# Altium project Wearable_sensor_v2.0.PrjPcb
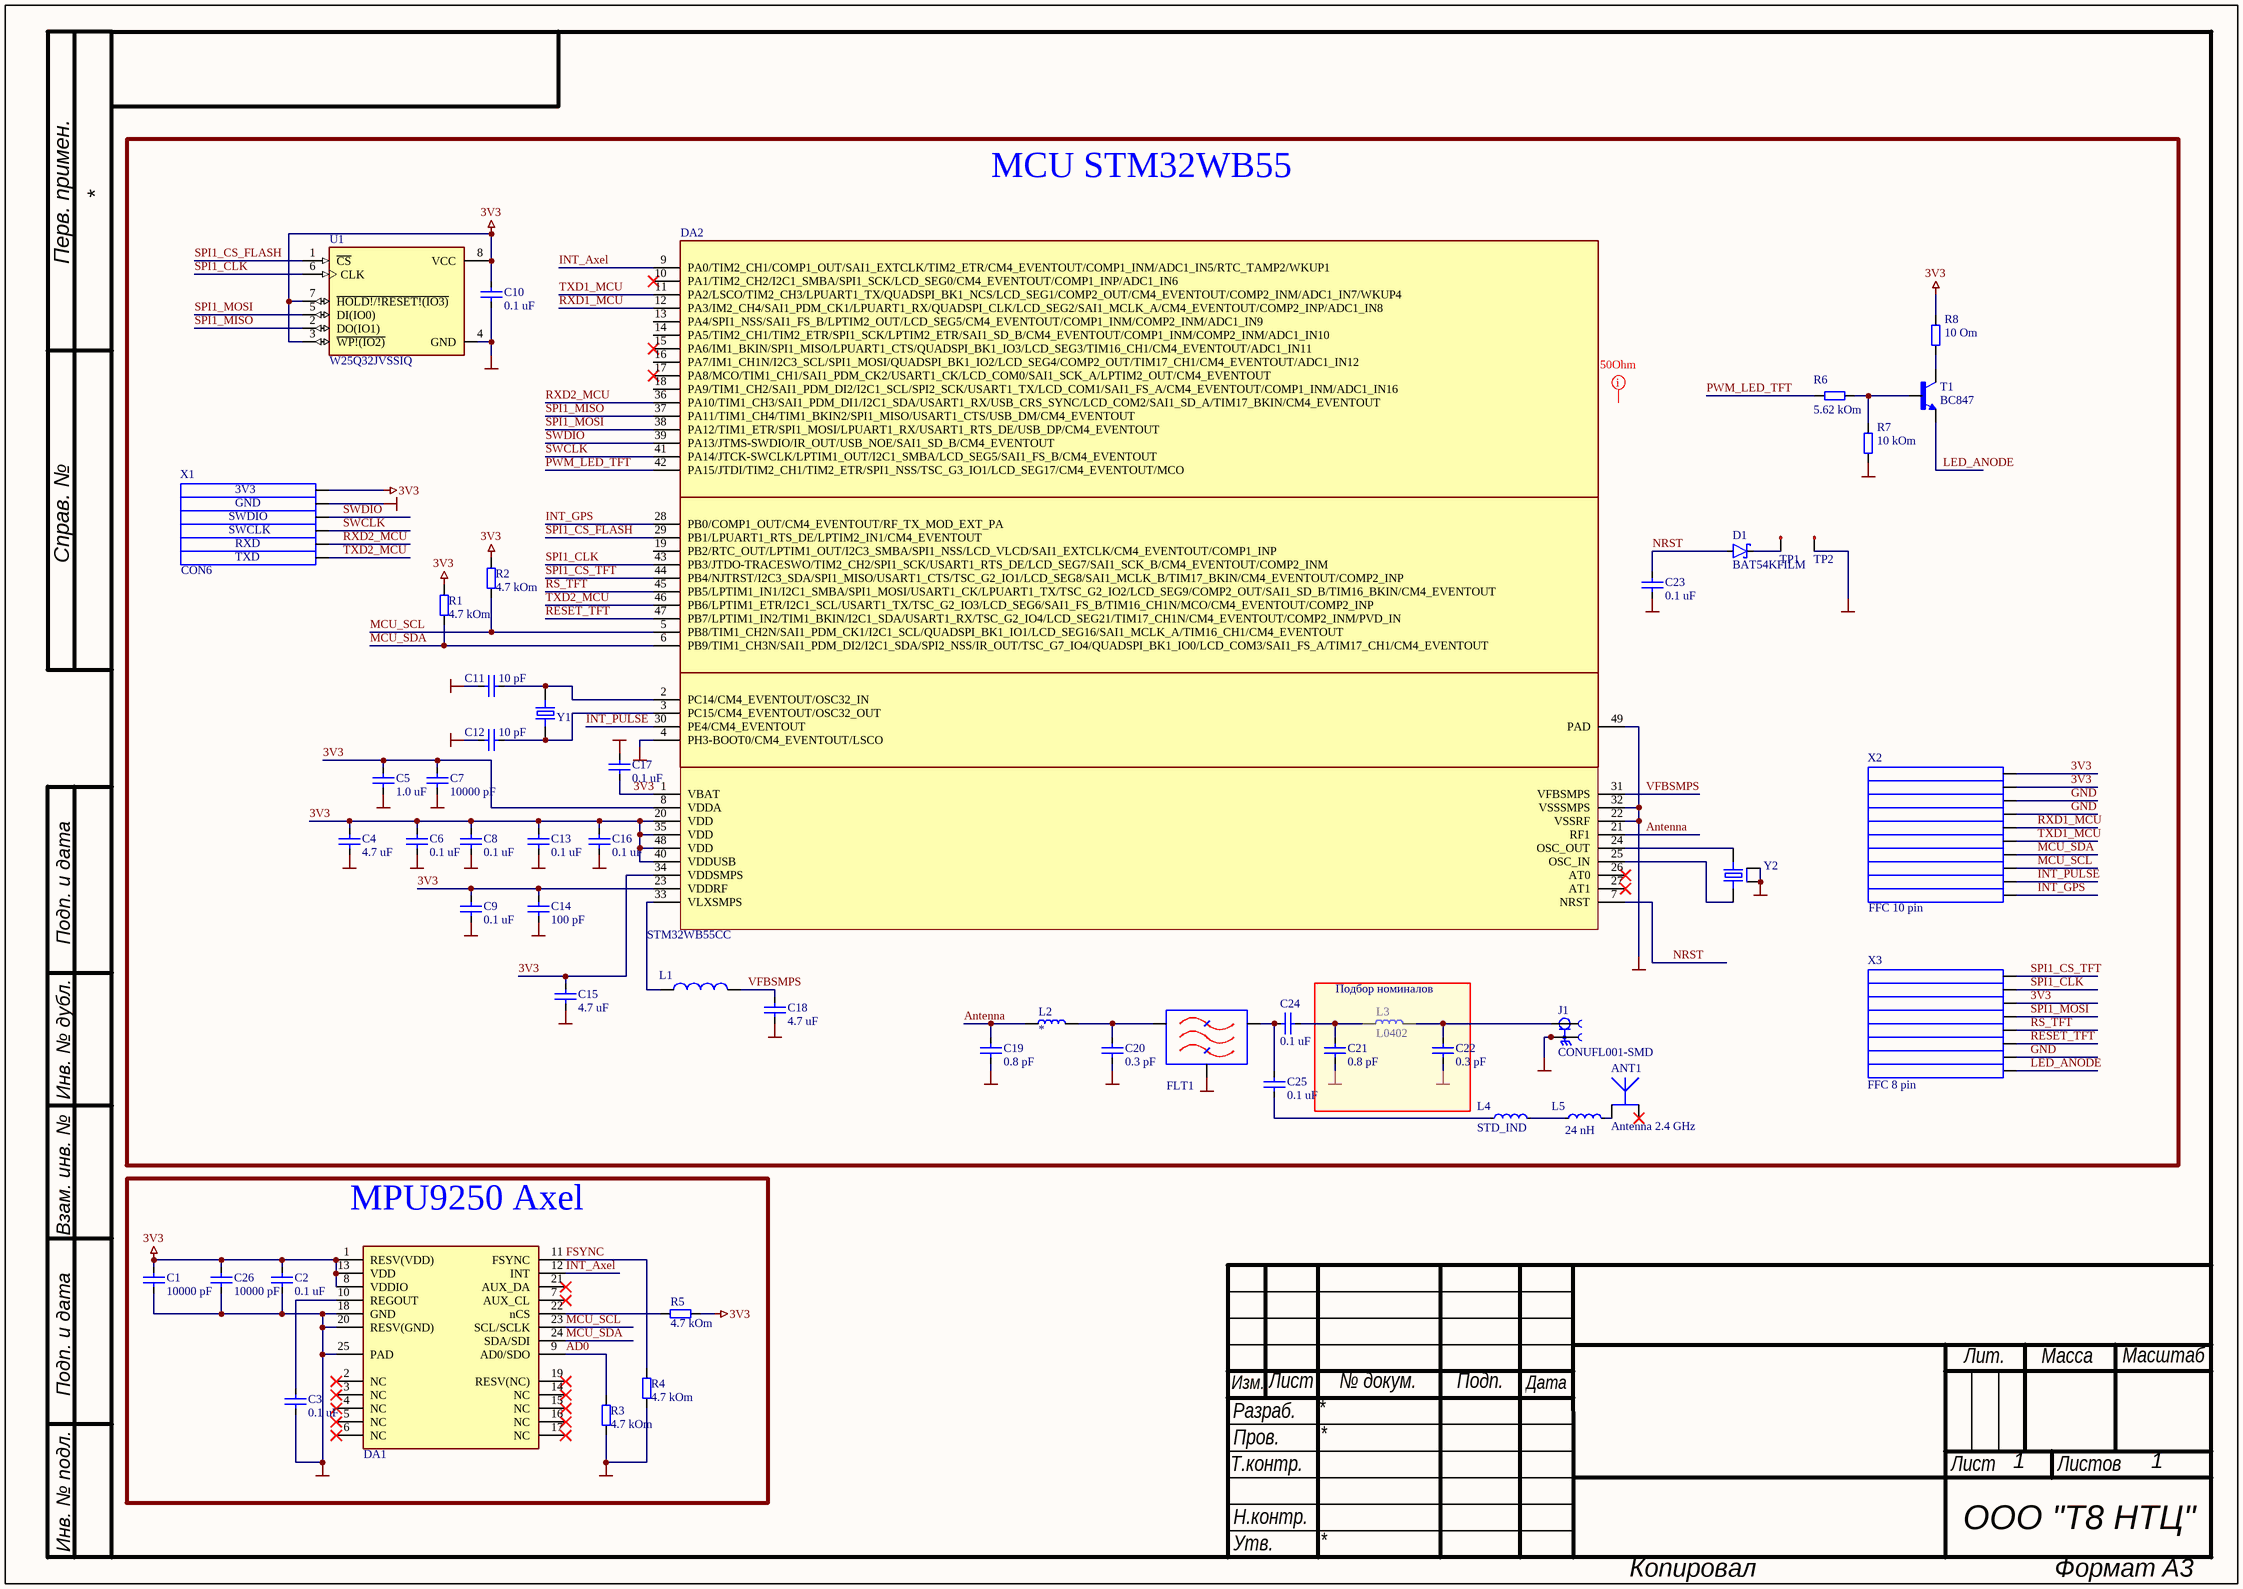
[diagram p0: Wearable_sensor_v2.0.SchDoc]
1 sheet, 54 parts. Net scope: global (net labels, ports and power ports of the same name join across sheets).
Board file: Wearable_sensor_v2.0.PcbDoc

## Sheet Wearable_sensor_v2.0.SchDoc
size 420 x 297 mm; SheetNumber: 1; SheetTotal: 1

### Parts
ANT1  Antenna 2.4 GHz  [RFANT3216120A5T]
C1  value 10000 pF  [CAPC1005X55N]  (hidden comment: STD_CAP)
C2  value 0.1 uF  [CAPC1005X55N]  (hidden comment: STD_CAP)
C3  value 0.1 uF  [CAPC1005X55N]  (hidden comment: STD_CAP)
C4  value 4.7 uF  [CAPC1005X55N]  (hidden comment: STD_CAP)
C5  value 1.0 uF  [CAPC1005X55N]  (hidden comment: STD_CAP)
C6  value 0.1 uF  [CAPC1005X55N]  (hidden comment: STD_CAP)
C7  value 10000 pF  [CAPC1005X55N]  (hidden comment: STD_CAP)
C8  value 0.1 uF  [CAPC1005X55N]  (hidden comment: STD_CAP)
C9  value 0.1 uF  [CAPC1005X55N]  (hidden comment: STD_CAP)
C10  value 0.1 uF  [CAPC1005X55N]  (hidden comment: STD_CAP)
C11  value 10 pF  [CAPC1005X55N]  (hidden comment: STD_CAP)
C12  value 10 pF  [CAPC1005X55N]  (hidden comment: STD_CAP)
C13  value 0.1 uF  [CAPC1005X55N]  (hidden comment: STD_CAP)
C14  value 100 pF  [CAPC1005X55N]  (hidden comment: STD_CAP)
C15  value 4.7 uF  [CAPC1005X55N]  (hidden comment: STD_CAP)
C16  value 0.1 uF  [CAPC1005X55N]  (hidden comment: STD_CAP)
C17  value 0.1 uF  [CAPC1005X55N]  (hidden comment: STD_CAP)
C18  value 4.7 uF  [CAPC1005X55N]  (hidden comment: STD_CAP)
C19  value 0.8 pF  [CAPC1005X55N]  (hidden comment: STD_CAP)
C20  value 0.3 pF  [CAPC1005X55N]  (hidden comment: STD_CAP)
C21  value 0.8 pF  [CAPC1005X55N]  (hidden comment: STD_CAP)
C22  value 0.3 pF  [CAPC1005X55N]  (hidden comment: STD_CAP)
C23  value 0.1 uF  [CAPC1005X55N]  (hidden comment: STD_CAP)
C24  value 0.1 uF  [CAPC1005X55N]  (hidden comment: STD_CAP)
C25  value 0.1 uF  [CAPC1005X55N]  (hidden comment: STD_CAP)
C26  value 10000 pF  [CAPC1005X55N]  (hidden comment: STD_CAP)
D1  BAT54KFILM  [SOD523]
DA1  IventSense_MPU-9250  [QFN24 3x3x1mm]  (value not drawn)
DA2  STM32WB55CC  [UFQFPN48]
FLT1  DEA162450-1260B2  [FIL_DEA160915LT-1169]  (value not drawn)
J1  CONUFL001-SMD  [LINX_CONUFL001-SMD]
L1  MLF2012E100KT000  [INDC2012X145N]  (value not drawn)
L2  L0402  [L0402]  (value not drawn)
L3  L0402  [L0402]
L4  STD_IND  [RESC1005X40N]
L5  value 24 nH  [RESC1005X40N]  (hidden comment: STD_IND)
R1  value 4.7 kOm  [RESC1005X40N]  (hidden comment: STD_RES)
R2  value 4.7 kOm  [RESC1005X40N]  (hidden comment: STD_RES)
R3  value 4.7 kOm  [RESC1005X40N]  (hidden comment: STD_RES)
R4  value 4.7 kOm  [RESC1005X40N]  (hidden comment: STD_RES)
R5  value 4.7 kOm  [RESC1005X40N]  (hidden comment: STD_RES)
R6  value 5.62 kOm  [RESC1005X40N]  (hidden comment: STD_RES)
R7  value 10 kOm  [RESC1005X40N]  (hidden comment: STD_RES)
R8  value 10 Om  [RESC1005X40N]  (hidden comment: STD_RES)
T1  BC847  [SOT23]
TP1  Test Point  [Test point]  (value not drawn)
TP2  Test Point  [Test point]  (value not drawn)
U1  W25Q32JVSSIQ  [SOIC127P790X216-8N]
X1  CON6  [CON6 cabel]
X2  FFC 10 pin  [SAMTEC_ZF5S-10-01-T-WT]
X3  FFC 8 pin  [68710814022]
Y1  NX2012SA-32.768K-STD-MUB-1_1  [XTAL_NX2012SA-32.768K-STD-MUB-1]  (value not drawn)
Y2  NX2016_32M  [NX2016_32M]  (value not drawn)

### Blocks framed on the sheet
MCU STM32WB55: ANT1 C4-C20 C23-C25 D1 DA2 FLT1 J1 L1 L2 L4 L5 R1 R2 R6-R8 T1 TP1 TP2 U1 X1-X3 Y1 Y2
Подбор номиналов: C21 C22 L3
MPU9250 Axel: C1-C3 C26 DA1 R3-R5

### Nets
3V3: C1.1 C2.1 C4.1 C5.1 C6.1 C7.1 C8.1 C9.1 C10.1 C13.1 C14.1 C15.1 C16.1 C17.2 C26.1 DA1.1(RESV(VDD)) DA1.8(VDDIO) DA1.13(VDD) DA2.1(VBAT) DA2.8(VDDA) DA2.20(VDD) DA2.23(VDDRF) DA2.34(VDDSMPS) DA2.35(VDD) DA2.40(VDDUSB) DA2.48(VDD) R1.2 R2.2 R5.1 R8.2 U1.3(~{WP!(IO2)}) U1.7(~{HOLD!/!RESET!(IO3)}) U1.8(VCC) X1.1 X2.1 X2.2 X3.3
GND: C1.2 C2.2 C3.2 C4.2 C5.2 C6.2 C7.2 C8.2 C9.2 C10.2 C11.2 C12.2 C13.2 C14.2 C15.2 C16.2 C17.1 C18.2 C19.2 C20.2 C21.2 C22.2 C23.2 C26.2 DA1.18(GND) DA1.20(RESV(GND)) DA1.25(PAD) DA2.4(PH3-BOOT0/CM4_EVENTOUT/LSCO) DA2.22(VSSRF) DA2.32(VSSSMPS) DA2.49(PAD) FLT1.2 J1.2 J1.3 R3.1 R4.1 R7.1 TP2.1 U1.4(GND) X1.2 X2.3 X2.4 X3.7 Y2.1 Y2.3
AD0: DA1.9(AD0/SDO) R3.2
Antenna: C19.1 DA2.21(RF1) L2.1
FSYNC: DA1.11(FSYNC) R4.2
INT_Axel: DA1.12(INT) DA2.9(PA0/TIM2_CH1/COMP1_OUT/SAI1_EXTCLK/TIM2_ETR/CM4_EVENTOUT/COMP1_INM/ADC1_IN5/RTC_TAMP2/WKUP1)
INT_GPS: DA2.28(PB0/COMP1_OUT/CM4_EVENTOUT/RF_TX_MOD_EXT_PA) X2.10
INT_PULSE: DA2.30(PE4/CM4_EVENTOUT) X2.9
LED_ANODE: T1.2(E) X3.8
MCU_SCL: DA1.23(SCL/SCLK) DA2.5(PB8/TIM1_CH2N/SAI1_PDM_CK1/I2C1_SCL/QUADSPI_BK1_IO1/LCD_SEG16/SAI1_MCLK_A/TIM16_CH1/CM4_EVENTOUT) R2.1 X2.8
MCU_SDA: DA1.24(SDA/SDI) DA2.6(PB9/TIM1_CH3N/SAI1_PDM_DI2/I2C1_SDA/SPI2_NSS/IR_OUT/TSC_G7_IO4/QUADSPI_BK1_IO0/LCD_COM3/SAI1_FS_A/TIM17_CH1/CM4_EVENTOUT) R1.1 X2.7
NRST: C23.1 D1.2(A) DA2.7(NRST)
PWM_LED_TFT: DA2.42(PA15/JTDI/TIM2_CH1/TIM2_ETR/SPI1_NSS/TSC_G3_IO1/LCD_SEG17/CM4_EVENTOUT/MCO) R6.2
RESET_TFT: DA2.47(PB7/LPTIM1_IN2/TIM1_BKIN/I2C1_SDA/USART1_RX/TSC_G2_IO4/LCD_SEG21/TIM17_CH1N/CM4_EVENTOUT/COMP2_INM/PVD_IN) X3.6
RS_TFT: DA2.45(PB5/LPTIM1_IN1/I2C1_SMBA/SPI1_MOSI/USART1_CK/LPUART1_TX/TSC_G2_IO2/LCD_SEG9/COMP2_OUT/SAI1_SD_B/TIM16_BKIN/CM4_EVENTOUT) X3.5
RXD1_MCU: DA2.12(PA3/IM2_CH4/SAI1_PDM_CK1/LPUART1_RX/QUADSPI_CLK/LCD_SEG2/SAI1_MCLK_A/CM4_EVENTOUT/COMP2_INP/ADC1_IN8) X2.5
RXD2_MCU: DA2.36(PA10/TIM1_CH3/SAI1_PDM_DI1/I2C1_SDA/USART1_RX/USB_CRS_SYNC/LCD_COM2/SAI1_SD_A/TIM17_BKIN/CM4_EVENTOUT) X1.5
SPI1_CLK: DA2.43(PB3/JTDO-TRACESWO/TIM2_CH2/SPI1_SCK/USART1_RTS_DE/LCD_SEG7/SAI1_SCK_B/CM4_EVENTOUT/COMP2_INM) U1.6(CLK) X3.2
SPI1_CS_FLASH: DA2.29(PB1/LPUART1_RTS_DE/LPTIM2_IN1/CM4_EVENTOUT) U1.1(~{CS})
SPI1_CS_TFT: DA2.44(PB4/NJTRST/I2C3_SDA/SPI1_MISO/USART1_CTS/TSC_G2_IO1/LCD_SEG8/SAI1_MCLK_B/TIM17_BKIN/CM4_EVENTOUT/COMP2_INP) X3.1
SPI1_MISO: DA2.37(PA11/TIM1_CH4/TIM1_BKIN2/SPI1_MISO/USART1_CTS/USB_DM/CM4_EVENTOUT) U1.2(DO(IO1))
SPI1_MOSI: DA2.38(PA12/TIM1_ETR/SPI1_MOSI/LPUART1_RX/USART1_RTS_DE/USB_DP/CM4_EVENTOUT) U1.5(DI(IO0)) X3.4
SWCLK: DA2.41(PA14/JTCK-SWCLK/LPTIM1_OUT/I2C1_SMBA/LCD_SEG5/SAI1_FS_B/CM4_EVENTOUT) X1.4
SWDIO: DA2.39(PA13/JTMS-SWDIO/IR_OUT/USB_NOE/SAI1_SD_B/CM4_EVENTOUT) X1.3
TXD1_MCU: DA2.11(PA2/LSCO/TIM2_CH3/LPUART1_TX/QUADSPI_BK1_NCS/LCD_SEG1/COMP2_OUT/CM4_EVENTOUT/COMP2_INM/ADC1_IN7/WKUP4) X2.6
TXD2_MCU: DA2.46(PB6/LPTIM1_ETR/I2C1_SCL/USART1_TX/TSC_G2_IO3/LCD_SEG6/SAI1_FS_B/TIM16_CH1N/MCO/CM4_EVENTOUT/COMP2_INP) X1.6
VFBSMPS: C18.1 DA2.31(VFBSMPS) L1.1
NetANT1_1: ANT1.1 L5.2
NetC3_1: C3.1 DA1.10(REGOUT)
NetC11_1: C11.1 DA2.2(PC14/CM4_EVENTOUT/OSC32_IN) Y1.2
NetC12_1: C12.1 DA2.3(PC15/CM4_EVENTOUT/OSC32_OUT) Y1.1
NetC20_1: C20.1 FLT1.1 L2.2
NetC21_1: C21.1 C24.2 L3.1
NetC22_1: C22.1 J1.1 L3.2
NetC24_1: C24.1 C25.2 FLT1.3
NetC25_1: C25.1 L4.1
NetD1_1: D1.1(K) TP1.1
NetDA1_22: DA1.22(nCS) R5.2
NetDA2_24: DA2.24(OSC_OUT) Y2.2
NetDA2_25: DA2.25(OSC_IN) Y2.4
NetDA2_33: DA2.33(VLXSMPS) L1.2
NetL4_2: L4.2 L5.1
NetR6_1: R6.1 R7.2 T1.1(B)
NetR8_1: R8.1 T1.3(C)

Not connected (* = marked no-connect by the designer): ANT1 2(1)*; DA1 2(NC)* 3(NC)* 4(NC)* 5(NC)* 6(NC)* 7(AUX_CL)* 14(NC)* 15(NC)* 16(NC)* 17(NC)* 19(RESV(NC))* 21(AUX_DA)*; DA2 10(PA1/TIM2_CH2/I2C1_SMBA/SPI1_SCK/LCD_SEG0/CM4_EVENTOUT/COMP1_INP/ADC1_IN6)* 13(PA4/SPI1_NSS/SAI1_FS_B/LPTIM2_OUT/LCD_SEG5/CM4_EVENTOUT/COMP1_INM/COMP2_INM/ADC1_IN9) 14(PA5/TIM2_CH1/TIM2_ETR/SPI1_SCK/LPTIM2_ETR/SAI1_SD_B/CM4_EVENTOUT/COMP1_INM/COMP2_INM/ADC1_IN10) 15(PA6/IM1_BKIN/SPI1_MISO/LPUART1_CTS/QUADSPI_BK1_IO3/LCD_SEG3/TIM16_CH1/CM4_EVENTOUT/ADC1_IN11)* 16(PA7/IM1_CH1N/I2C3_SCL/SPI1_MOSI/QUADSPI_BK1_IO2/LCD_SEG4/COMP2_OUT/TIM17_CH1/CM4_EVENTOUT/ADC1_IN12) 17(PA8/MCO/TIM1_CH1/SAI1_PDM_CK2/USART1_CK/LCD_COM0/SAI1_SCK_A/LPTIM2_OUT/CM4_EVENTOUT)* 18(PA9/TIM1_CH2/SAI1_PDM_DI2/I2C1_SCL/SPI2_SCK/USART1_TX/LCD_COM1/SAI1_FS_A/CM4_EVENTOUT/COMP1_INM/ADC1_IN16) 19(PB2/RTC_OUT/LPTIM1_OUT/I2C3_SMBA/SPI1_NSS/LCD_VLCD/SAI1_EXTCLK/CM4_EVENTOUT/COMP1_INP) 26(AT0)* 27(AT1)*

### Layout directives
mark named 50Ohm: (no net found under the mark)

### Notes on the sheet
- SWDIO
- SWCLK
- 3V3
- GND
- RXD
- TXD
- Перв. примен.
- Справ. №
- Подп. и дата
- Инв. № дубл.
- Взам. инв. №
- Изм.
- Лист
- № докум.
- Подп.
- Дата
- Лит.
- Масса
- Масштаб
- Т.контр.
- Разраб.
- Пров.
- Листов
- Инв. № подл.
- Н.контр.
- ООО "Т8 НТЦ"
- Утв.
- Копировал
- Формат А3

### Library data of the parts
ANT1 = Antenna 2.4
C1 C7 C26 = 3808: ManufacturerPartnumber: GRM155R71H103KA88D; Manufacturer: muRata; Number_Base: 3808; Comp_ID: 200003-0407; Lib_Description: Capacitor; Comp_Description: Capacitors 0402 10000 pF ±10% 50V  X7R; Human_Readable: Конденсатор 0402 10000 pF ±10% 50V  X7R; Precision: ±10%; Temp_Range: -55 to 125°C; Voltage_Range: 50V; Dielectric: X7R; Comp_Class_Number: 200003; Comp_Class_Name: Capacitors Chip SMD 0402; AuthorModification_Comp: anosova; BOM: Конденсатор 0402 10000 pF ±10% 50V  X7R    GRM155R71H103KA88D muRata; Footprint_Description: Chip Capacitor EIA 0402. METRIC 1005, 2-Leads, Body 1,00x0,5mm, IPC Medium Density; HelpURL: \\corp1\RNDlibrary\_Library\Altium_lib\Datasheet\muRata\Chip_Monolithic_Ceramic_Capacitors\Chip_Monolithic_Ceramic_Capacitors.pdf; ComponentLink1Description: MANUFACTURER_URL; ComponentLink1URL: http://www.murata.com/products/catalog/pdf/c02e.pdf; Price: 0,136999994516373; TimeModification_Comp: 18.11.2021 13:06:28
C2 C3 C6 C8-C10 C13 C16 C17 C23 = 5571: ManufacturerPartnumber: GRM155R71H104KE14D; Manufacturer: muRata; Number_Base: 5571; Comp_ID: 200003-430; Lib_Description: Capacitor; Comp_Description: Capacitors 0402 0.10 uF ±10% 50V X7R; Human_Readable: Конденсатор 0402 0.1 uF ±10% 50V X7R; Precision: 10%; Temp_Range: -55°C to +125°C; Voltage_Range: 50V; Dielectric: X7R; Comp_Class_Number: 200003; Comp_Class_Name: Capacitors Chip SMD 0402; AuthorCreation_Comp: altium_lib_sch_p; AuthorModification_Comp: anosova; BOM: Конденсатор 0402 0.1 uF ±10% 50V X7R    GRM155R71H104KE14D muRata; Footprint_Description: Chip Capacitor EIA 0402. METRIC 1005, 2-Leads, Body 1,00x0,5mm, IPC Medium Density; HelpURL: \\corp1\RNDlibrary\_Library\Altium_lib\Datasheet\muRata\Chip_Monolithic_Ceramic_Capacitors\c02e.pdf; ComponentLink1Description: MANUFACTURER_URL; ComponentLink1URL: https://www.murata.com/~/media/webrenewal/support/library/catalog/products/capacitor/mlcc/c02e.ashx; Verified: N; TimeCreation_Comp: 05.04.2018 11:21:57; TimeModification_Comp: 18.11.2021 13:11:41
C4 C15 C18 = 5279: ManufacturerPartnumber: GRM155R60J475M; Manufacturer: muRata; Number_Base: 5279; Comp_ID: 200003-427; Lib_Description: Capacitor; Comp_Description: Capacitors 0402 4.7 uF ±20% 6.3V X5R; Human_Readable: Конденсатор 0402 4.7 uF ±20% 6.3V X5R; Precision: ±20%; Temp_Range: -55°C to +85°C; Voltage_Range: 6.3V; Dielectric: X5R; Comp_Class_Number: 200003; Comp_Class_Name: Capacitors Chip SMD 0402; AuthorCreation_Comp: asergeev; AuthorModification_Comp: anosova; BOM: Конденсатор 0402 4.7 uF ±20% 6.3V X5R    GRM155R60J475M muRata; Footprint_Description: Chip Capacitor EIA 0402. METRIC 1005, 2-Leads, Body 1,00x0,5mm, IPC Medium Density; HelpURL: \\corp1\RNDlibrary\_Library\Altium_lib\Datasheet\muRata\Chip_Monolithic_Ceramic_Capacitors\c02e.pdf; ComponentLink1Description: MANUFACTURER_URL; ComponentLink1URL: http://psearch.murata.com/capacitor/lineup/grm/; Verified: N; Price: 0,100000001490116; TimeCreation_Comp: 03.09.2014 18:07:40; TimeModification_Comp: 18.11.2021 13:10:53
C5 = 5280: ManufacturerPartnumber: GRM155R61A105K; Manufacturer: muRata; Number_Base: 5280; Comp_ID: 200003-428; Lib_Description: Capacitor; Comp_Description: Capacitors 0402 1.0 uF ±10% 10V X5R; Human_Readable: Конденсатор 0402 1.0 uF ±10% 10V X5R; Precision: ±10%; Temp_Range: -55°C to +85°C; Voltage_Range: 10V; Dielectric: X5R; Comp_Class_Number: 200003; Comp_Class_Name: Capacitors Chip SMD 0402; AuthorCreation_Comp: asergeev; AuthorModification_Comp: anosova; BOM: Конденсатор 0402 1.0 uF ±10% 10V X5R    GRM155R61A105K muRata; Footprint_Description: Chip Capacitor EIA 0402. METRIC 1005, 2-Leads, Body 1,00x0,5mm, IPC Medium Density; HelpURL: \\corp1\RNDlibrary\_Library\Altium_lib\Datasheet\muRata\Chip_Monolithic_Ceramic_Capacitors\c02e.pdf; ComponentLink1Description: MANUFACTURER_URL; ComponentLink1URL: http://psearch.murata.com/capacitor/lineup/grm/; Verified: N; Price: 0,100000001490116; TimeCreation_Comp: 03.09.2014 18:19:09; TimeModification_Comp: 18.11.2021 13:11:06
C11 C12 = 3739: ManufacturerPartnumber: GRM1555C1H100GA01D; Manufacturer: muRata; Number_Base: 3739; Comp_ID: 200003-0338; Lib_Description: Capacitor; Comp_Description: Capacitors 0402 10 pF ±2% 50V  C0G (NP0); Human_Readable: Конденсатор 0402 10 pF ±2% 50V  C0G (NP0); Precision: ±2%; Temp_Range: 25 to 125°C; Voltage_Range: 50V; Dielectric: C0G (NP0); Comp_Class_Number: 200003; Comp_Class_Name: Capacitors Chip SMD 0402; AuthorModification_Comp: anosova; BOM: Конденсатор 0402 10 pF ±2% 50V  C0G (NP0)    GRM1555C1H100GA01D muRata; Footprint_Description: Chip Capacitor EIA 0402. METRIC 1005, 2-Leads, Body 1,00x0,5mm, IPC Medium Density; HelpURL: \\corp1\RNDlibrary\_Library\Altium_lib\Datasheet\muRata\Chip_Monolithic_Ceramic_Capacitors\Chip_Monolithic_Ceramic_Capacitors.pdf; ComponentLink1Description: MANUFACTURER_URL; ComponentLink1URL: http://www.murata.com/products/catalog/pdf/c02e.pdf; TimeModification_Comp: 18.11.2021 12:46:42
C14 = 3763: ManufacturerPartnumber: GRM1555C1H101GA01D; Manufacturer: muRata; Number_Base: 3763; Comp_ID: 200003-0362; Lib_Description: Capacitor; Comp_Description: Capacitors 0402 100 pF ±2% 50V  C0G (NP0); Human_Readable: Конденсатор 0402 100 pF ±2% 50V  C0G (NP0); Precision: ±2%; Temp_Range: 25 to 125°C; Voltage_Range: 50V; Dielectric: C0G (NP0); Comp_Class_Number: 200003; Comp_Class_Name: Capacitors Chip SMD 0402; AuthorModification_Comp: anosova; BOM: Конденсатор 0402 100 pF ±2% 50V  C0G (NP0)    GRM1555C1H101GA01D muRata; Footprint_Description: Chip Capacitor EIA 0402. METRIC 1005, 2-Leads, Body 1,00x0,5mm, IPC Medium Density; HelpURL: \\corp1\RNDlibrary\_Library\Altium_lib\Datasheet\muRata\Chip_Monolithic_Ceramic_Capacitors\Chip_Monolithic_Ceramic_Capacitors.pdf; ComponentLink1Description: MANUFACTURER_URL; ComponentLink1URL: http://www.murata.com/products/catalog/pdf/c02e.pdf; Price: 0,0270000007003546; TimeModification_Comp: 18.11.2021 12:51:46
C19 C21 = 3416: ManufacturerPartnumber: GRM1555C1HR80WA01D; Manufacturer: muRata; Number_Base: 3416; Comp_ID: 200003-0015; Lib_Description: Capacitor; Comp_Description: Capacitors 0402 0.8 pF ±0.05 pF 50V  C0G (NP0); Human_Readable: Конденсатор 0402 0.8 pF ±0.05 pF 50V  C0G (NP0); Precision: ±0.05pF; Temp_Range: 25 to 125°C; Voltage_Range: 50V; Dielectric: C0G (NP0); Comp_Class_Number: 200003; Comp_Class_Name: Capacitors Chip SMD 0402; AuthorModification_Comp: anosova; BOM: Конденсатор 0402 0.8 pF ±0.05 pF 50V  C0G (NP0)    GRM1555C1HR80WA01D muRata; Footprint_Description: Chip Capacitor EIA 0402. METRIC 1005, 2-Leads, Body 1,00x0,5mm, IPC Medium Density; HelpURL: \\corp1\RNDlibrary\_Library\Altium_lib\Datasheet\muRata\Chip_Monolithic_Ceramic_Capacitors\Chip_Monolithic_Ceramic_Capacitors.pdf; ComponentLink1Description: MANUFACTURER_URL; ComponentLink1URL: http://www.murata.com/products/catalog/pdf/c02e.pdf; TimeModification_Comp: 16.11.2021 12:21:27
C20 C22 = 3406: ManufacturerPartnumber: GRM1555C1HR30WA01D; Manufacturer: muRata; Number_Base: 3406; Comp_ID: 200003-0005; Lib_Description: Capacitor; Comp_Description: Capacitors 0402 0.3 pF ±0.05 pF 50V  C0G (NP0); Human_Readable: Конденсатор 0402 0.3 pF ±0.05 pF 50V  C0G (NP0); Precision: ±0.05pF; Temp_Range: 25 to 125°C; Voltage_Range: 50V; Dielectric: C0G (NP0); Comp_Class_Number: 200003; Comp_Class_Name: Capacitors Chip SMD 0402; AuthorModification_Comp: anosova; BOM: Конденсатор 0402 0.3 pF ±0.05 pF 50V  C0G (NP0)    GRM1555C1HR30WA01D muRata; Footprint_Description: Chip Capacitor EIA 0402. METRIC 1005, 2-Leads, Body 1,00x0,5mm, IPC Medium Density; HelpURL: \\corp1\RNDlibrary\_Library\Altium_lib\Datasheet\muRata\Chip_Monolithic_Ceramic_Capacitors\Chip_Monolithic_Ceramic_Capacitors.pdf; ComponentLink1Description: MANUFACTURER_URL; ComponentLink1URL: http://www.murata.com/products/catalog/pdf/c02e.pdf; TimeModification_Comp: 16.11.2021 12:19:31
C24 C25 = 6193: ManufacturerPartnumber: CC0402KRX7R8BB104; Manufacturer: Yageo; Number_Base: 6193; Comp_ID: 200003-432; Lib_Description: Capacitor; Comp_Description: Capacitors 0402 0.10 uF ±10% 25V X7R; Human_Readable: Конденсатор 0402 0.1 uF ±10% 25V X7R; Precision: ±10%; Temp_Range: -55°C to +125°C; Voltage_Range: 25V; Comp_Class_Number: 200003; Comp_Class_Name: Capacitors Chip SMD 0402; AuthorCreation_Comp: anosova; BOM: Конденсатор 0402 0.1 uF ±10% 25V X7R    CC0402KRX7R8BB104 Yageo; Footprint_Description: Chip Capacitor EIA 0402-BGA. METRIC 1005, 2-Leads, Body 1,00x0,5mm, IPC Medium Density; HelpURL: \\corp1\RNDlibrary\_Library\Altium_lib\Datasheet\Yageo\CC_X7R\CC_X7R.pdf; ComponentLink1Description: MANUFACTURER_URL; ComponentLink1URL: https://www.yageo.com/upload/media/product/productsearch/datasheet/mlcc/UPY-GPHC_X7R_6.3V-to-50V_20.pdf; Verified: N; TimeCreation_Comp: 25.10.2021 13:07:08; AuthorModification_Comp: anosova; TimeModification_Comp: 18.11.2021 13:12:19
D1 = BAT54KFILM: Diode Schottky; Manufacturer: STMicroelectronics; BOM: Diode schottky    BAT54KFILM STMicroelectronics; Package: None; Price: None; Value: *; Availability: Unavailable; ManufacturerPartnumber: BAT54KFILM; Footprint_Description: SOD523; Human_Readable: Diode schottky; Parameter 4: *
DA1 = MPU-9250: Manufacturer: InvenSense; Help: D:\HSE\Трекер физ состояния\Help\mpu9265.pdf; BOM: Акселерометр    MPU-9250 InvenSense; Human_Readable: Акселерометр; ComponentLink1Description: Help; ComponentLink1URL: D:\HSE\Трекер физ состояния\Help\mpu9265.pdf; ManufacturerPartnumber: MPU-9250; Footprint_Description: QFN23 3x3
DA2 = STM32WB55: Manufacturer: STMicroelectronics; BOM: Микроконтроллер    STM32WB55CC STMicroelectronics; Human_Readable: Микроконтроллер; ComponentLink1Description: Help; ComponentLink1URL: D:\HSE\Трекер физ состояния\Help\stm32wb55cc.pdf; Footprint_Description: QFN48; ManufacturerPartnumber: STM32WB55CC
FLT1 = DEA162450-1260B2: Band Pass Filter TDK DEA162450-1260B2; BOM: Фильтр BLE    DEA162450-1260B2 TDK; Human_Readable: Фильтр BLE; ManufacturerPartnumber: DEA162450-1260B2; Manufacturer: TDK; Footprint_Description: SMD-3
J1 = CONUFL001-SMD: Manufacturer: TE Connectivity; ManufacturerPartnumber: 1909763-1; BOM: UMCC разъем    1909763-1 TE Connectivity; Human_Readable: UMCC разъем; Availability: In Stock; Price: None; SnapEDA_Link: https://www.snapeda.com/parts/CONUFL001-SMD/Linx/view-part/5842340/?ref=snap; Value: *; Check_prices: https://www.snapeda.com/parts/CONUFL001-SMD/Linx/view-part/5842340/?ref=eda; Package: None; Footprint_Description: UMCC; Parameter 4: *; Parameter 5: *
L1 = MLF2012E100KT000: 10 ÂµH Shielded Multilayer Inductor 15 mA 800mOhm Max 0805 (2012 Metric); MF: TDK; Value: 10 uH; BOM: MLF2012E100KT000 TDK; Package: 0805 TDK Corporation; Price: None; Check_prices: https://www.snapeda.com/parts/MLF2012E100KT000/TDK/view-part/?ref=eda; MP: MLF2012E100KT000; Availability: In Stock; Purchase-URL: https://pricing.snapeda.com/search?q=MLF2012E100KT000&ref=eda; ManufacturerPartnumber: MLF2012E100KT000; Manufacturer: TDK; Footprint_Description: 0805 TDK Corporation
L2 L3 = L0402: Fixed Inductors 0402; MF: Murata; MP: LQG15HN1N5S00D; SnapEDA_Link: https://www.snapeda.com/parts/LQG15HN1N5S00D/Murata/view-part/1646487/?ref=snap; Price: None; Check_prices: https://www.snapeda.com/parts/LQG15HN1N5S00D/Murata/view-part/1646487/?ref=eda; Value: *; Availability: Bad; Package: 0402 Murata
L4 = 5343: ManufacturerPartnumber: LQW15AN24NG00; Manufacturer: muRata; Value: 24 nH; Number_Base: 5343; Comp_ID: 13010000-030; Lib_Description: RF Inductor wire wound 0402 Size; Precision: ±2%; Temp_Range: -55°C to +125°C; Current_Range: 280 mA; Comp_Class_Number: 13010000; Comp_Class_Name: Inductances Chip; AuthorCreation_Comp: altium_lib_sch_p; BOM: RF Inductor wire wound 0402 Size    LQW15AN24NG00 muRata; Price: 0,239999994635582; Comp_Description: RF Inductor wire wound 0402 Size; Human_Readable: RF Inductor wire wound 0402 Size; HelpURL: \\Corp1\RNDlibrary\_Library\Altium_lib\Datasheet\muRata\Chip_Inductors\Chip_Inductors.o05e.pdf; ComponentLink1Description: MANUFACTURER_URL; Verified: N; TimeCreation_Comp: 10.06.2015 18:13:48; AuthorModification_Comp: altium_lib_sch_p; TimeModification_Comp: 10.06.2015 18:37:11
L5 = 5343: ManufacturerPartnumber: LQW15AN24NG00; Manufacturer: muRata; Number_Base: 5343; Comp_ID: 13010000-030; Lib_Description: RF Inductor wire wound 0402 Size; Precision: ±2%; Temp_Range: -55°C to +125°C; Current_Range: 280 mA; Comp_Class_Number: 13010000; Comp_Class_Name: Inductances Chip; AuthorCreation_Comp: altium_lib_sch_p; BOM: RF Inductor wire wound 0402 Size    LQW15AN24NG00 muRata; Price: 0,239999994635582; Comp_Description: RF Inductor wire wound 0402 Size; Human_Readable: RF Inductor wire wound 0402 Size; HelpURL: \\Corp1\RNDlibrary\_Library\Altium_lib\Datasheet\muRata\Chip_Inductors\Chip_Inductors.o05e.pdf; ComponentLink1Description: MANUFACTURER_URL; Verified: N; TimeCreation_Comp: 10.06.2015 18:13:48; AuthorModification_Comp: altium_lib_sch_p; TimeModification_Comp: 10.06.2015 18:37:11
R1-R5 = 3312: ManufacturerPartnumber: RC0402JR-074K7L; Manufacturer: Yageo; Number_Base: 3312; Comp_ID: 1033-089; Lib_Description: Resistor; Comp_Description: Resistor 0402 5% E24 4.7 kOm; Human_Readable: Резистор 0402 5% E24 4,7 кОм; Precision: 5%; Temp_Range: -55 °C to +155 °C; Power_Range: 0.0625W; Comp_Class_Number: 10000303; Comp_Class_Name: Resistors Chip SMD 0402 5% E24; BOM: Резистор 0402 5% E24 4,7 кОм    RC0402JR-074K7L Yageo; Footprint_Description: Chip Resistor EIA 0402. METRIC 1005, 2-Leads, Body 1,00x0,5mm, IPC Medium Density; HelpURL: \\corp1\RNDlibrary\_Library\Altium_lib\Datasheet\Yageo\RC0402\PYu-RC0402_51_RoHS_L_6.pdf; ComponentLink1Description: MANUFACTURER_URL; ComponentLink1URL: http://www.yageo.com/documents/recent/PYu-RC0402_51_RoHS_L_6.pdf; Price: 0,00600000005215406; TimeModification_Comp: 09.12.2011 8:02:28
R6 = 2911: ManufacturerPartnumber: RC0402FR-075K62L; Manufacturer: Yageo; Number_Base: 2911; Comp_ID: 11010201-361; Lib_Description: Resistor; Comp_Description: Resistor 0402 1% E96 5.62 kOm; Human_Readable: Резистор 0402 1% E96 5,62 кОм; Precision: 1%; Temp_Range: -55 °C to +155 °C; Power_Range: 0.0625W; Comp_Class_Number: 11010201; Comp_Class_Name: Resistors Chip SMD 0402 1% E96; BOM: Резистор 0402 1% E96 5,62 кОм    RC0402FR-075K62L Yageo; Footprint_Description: Chip Resistor EIA 0402. METRIC 1005, 2-Leads, Body 1,00x0,5mm, IPC Medium Density; HelpURL: \\corp1\RNDlibrary\_Library\Altium_lib\Datasheet\Yageo\RC0402\PYu-RC0402_51_RoHS_L_6.pdf; ComponentLink1Description: MANUFACTURER_URL; ComponentLink1URL: http://www.yageo.com/documents/recent/PYu-RC0402_51_RoHS_L_6.pdf; Price: 0,00600000005215406; TimeModification_Comp: 06.12.2011 13:34:56
R7 = 2935: ManufacturerPartnumber: RC0402FR-0710K0L; Manufacturer: Yageo; Number_Base: 2935; Comp_ID: 11010201-385; Lib_Description: Resistor; Comp_Description: Resistor 0402 1% E96 10 kOm; Human_Readable: Резистор 0402 1% E96 10 кОм; Precision: 1%; Temp_Range: -55 °C to +155 °C; Power_Range: 0.0625W; Comp_Class_Number: 11010201; Comp_Class_Name: Resistors Chip SMD 0402 1% E96; BOM: Резистор 0402 1% E96 10 кОм    RC0402FR-0710K0L Yageo; Footprint_Description: Chip Resistor EIA 0402. METRIC 1005, 2-Leads, Body 1,00x0,5mm, IPC Medium Density; HelpURL: \\corp1\RNDlibrary\_Library\Altium_lib\Datasheet\Yageo\RC0402\PYu-RC0402_51_RoHS_L_6.pdf; ComponentLink1Description: MANUFACTURER_URL; ComponentLink1URL: http://www.yageo.com/documents/recent/PYu-RC0402_51_RoHS_L_6.pdf; Price: 0,00600000005215406; TimeModification_Comp: 06.12.2011 13:34:56
R8 = 2647: ManufacturerPartnumber: RC0402FR-0710R0L; Manufacturer: Yageo; Number_Base: 2647; Comp_ID: 11010201-97; Lib_Description: Resistor; Comp_Description: Resistor 0402 1% E96 10 Om; Human_Readable: Резистор 0402 1% E96 10 Ом; Precision: 1%; Temp_Range: -55 °C to +155 °C; Power_Range: 0.0625W; Comp_Class_Number: 11010201; Comp_Class_Name: Resistors Chip SMD 0402 1% E96; BOM: Резистор 0402 1% E96 10 Ом    RC0402FR-0710R0L Yageo; Footprint_Description: Chip Resistor EIA 0402. METRIC 1005, 2-Leads, Body 1,00x0,5mm, IPC Medium Density; HelpURL: \\corp1\RNDlibrary\_Library\Altium_lib\Datasheet\Yageo\RC0402\PYu-RC0402_51_RoHS_L_6.pdf; ComponentLink1Description: MANUFACTURER_URL; ComponentLink1URL: http://www.yageo.com/documents/recent/PYu-RC0402_51_RoHS_L_6.pdf; Price: 0,00600000005215406; TimeModification_Comp: 06.12.2011 13:34:55
T1 = BC847: <b>NPN TRANSISTOR</b>; Availability: Unavailable; Package: None; MP: BC847; Value: *; Price: None
U1 = W25Q32JVSSIQ: FLASH - NOR Memory IC 32Mb _4M x 8_ SPI - Quad I/O 133MHz 8-SOIC; MF: Winbond; BOM: SPI Flash    W25Q32JVSSIQ Winbond; Human_Readable: SPI Flash; Package: SOIC-8 Winbond; Price: None; SnapEDA_Link: https://www.snapeda.com/parts/W25Q32JVSSIQ/Winbond%20Electronics/view-part/596953/?ref=snap; Availability: Unavailable; MP: W25Q32JVSSIQ; ManufacturerPartnumber: W25Q32JVSSIQ; Manufacturer: Winbond; Footprint_Description: SOIC-8 Winbond
X1 = CON6: Коннектор 6-ти контактный; ManufacturerPartnumber: PLS-4; Manufacturer: Connfly; BOM: Разъем 4 контакта    PLS-4 Connfly; Human_Readable: Разъем 4 контакта; Footprint_Description: PLS-4
X2 = FFC 10 pin: FFC connector 8 pin
X3 = FFC 8 pin: FFC connector 8 pin
Y1 = NX2012SA-32.768K-STD-MUB-1_1: 32.768 kHz Â±20ppm Crystal 12.5pF 80 kOhms 2-SMD, No Lead; MF: NDK America,; BOM: 32 kHz Crystal    NX2012SA-32.768K-STD-MUB-1 NDK America,; Human_Readable: 32 kHz Crystal; Package: SMD-2 NDK; Price: None; Check_prices: https://www.snapeda.com/parts/NX2012SA-32.768K-STD-MUB-1/NDK+America%252C+Inc./view-part/?ref=eda; Value: *; SnapEDA_Link: https://www.snapeda.com/parts/NX2012SA-32.768K-STD-MUB-1/NDK+America%252C+Inc./view-part/?ref=snap; MP: NX2012SA-32.768K-STD-MUB-1; Availability: In Stock; Purchase-URL: https://pricing.snapeda.com/search/part/NX2012SA-32.768K-STD-MUB-1/?ref=eda; ManufacturerPartnumber: NX2012SA-32.768K-STD-MUB-1; Manufacturer: NDK America,; Footprint_Description: SMD-2 NDK
Y2 = NX2016_32M: 32 MHz  Crystal; ManufacturerPartnumber: NX2016SA-32MHZ; MF: NDK America,; Value: 32 MHz; MP: NX2012SA-32.768K-STD-MUB-1; BOM: Crystal 32MHz    NX2016SA-32MHZ NDK America,; Human_Readable: Crystal 32MHz; Package: SMD-2 NDK; Price: None; Check_prices: https://www.snapeda.com/parts/NX2012SA-32.768K-STD-MUB-1/NDK+America%252C+Inc./view-part/?ref=eda; SnapEDA_Link: https://www.snapeda.com/parts/NX2012SA-32.768K-STD-MUB-1/NDK+America%252C+Inc./view-part/?ref=snap; Availability: In Stock; Purchase-URL: https://pricing.snapeda.com/search/part/NX2012SA-32.768K-STD-MUB-1/?ref=eda; Manufacturer: NDK America,; Footprint_Description: SMD-2 NDK